# EAGLE design Sensorboard (EAGLE 6.1)
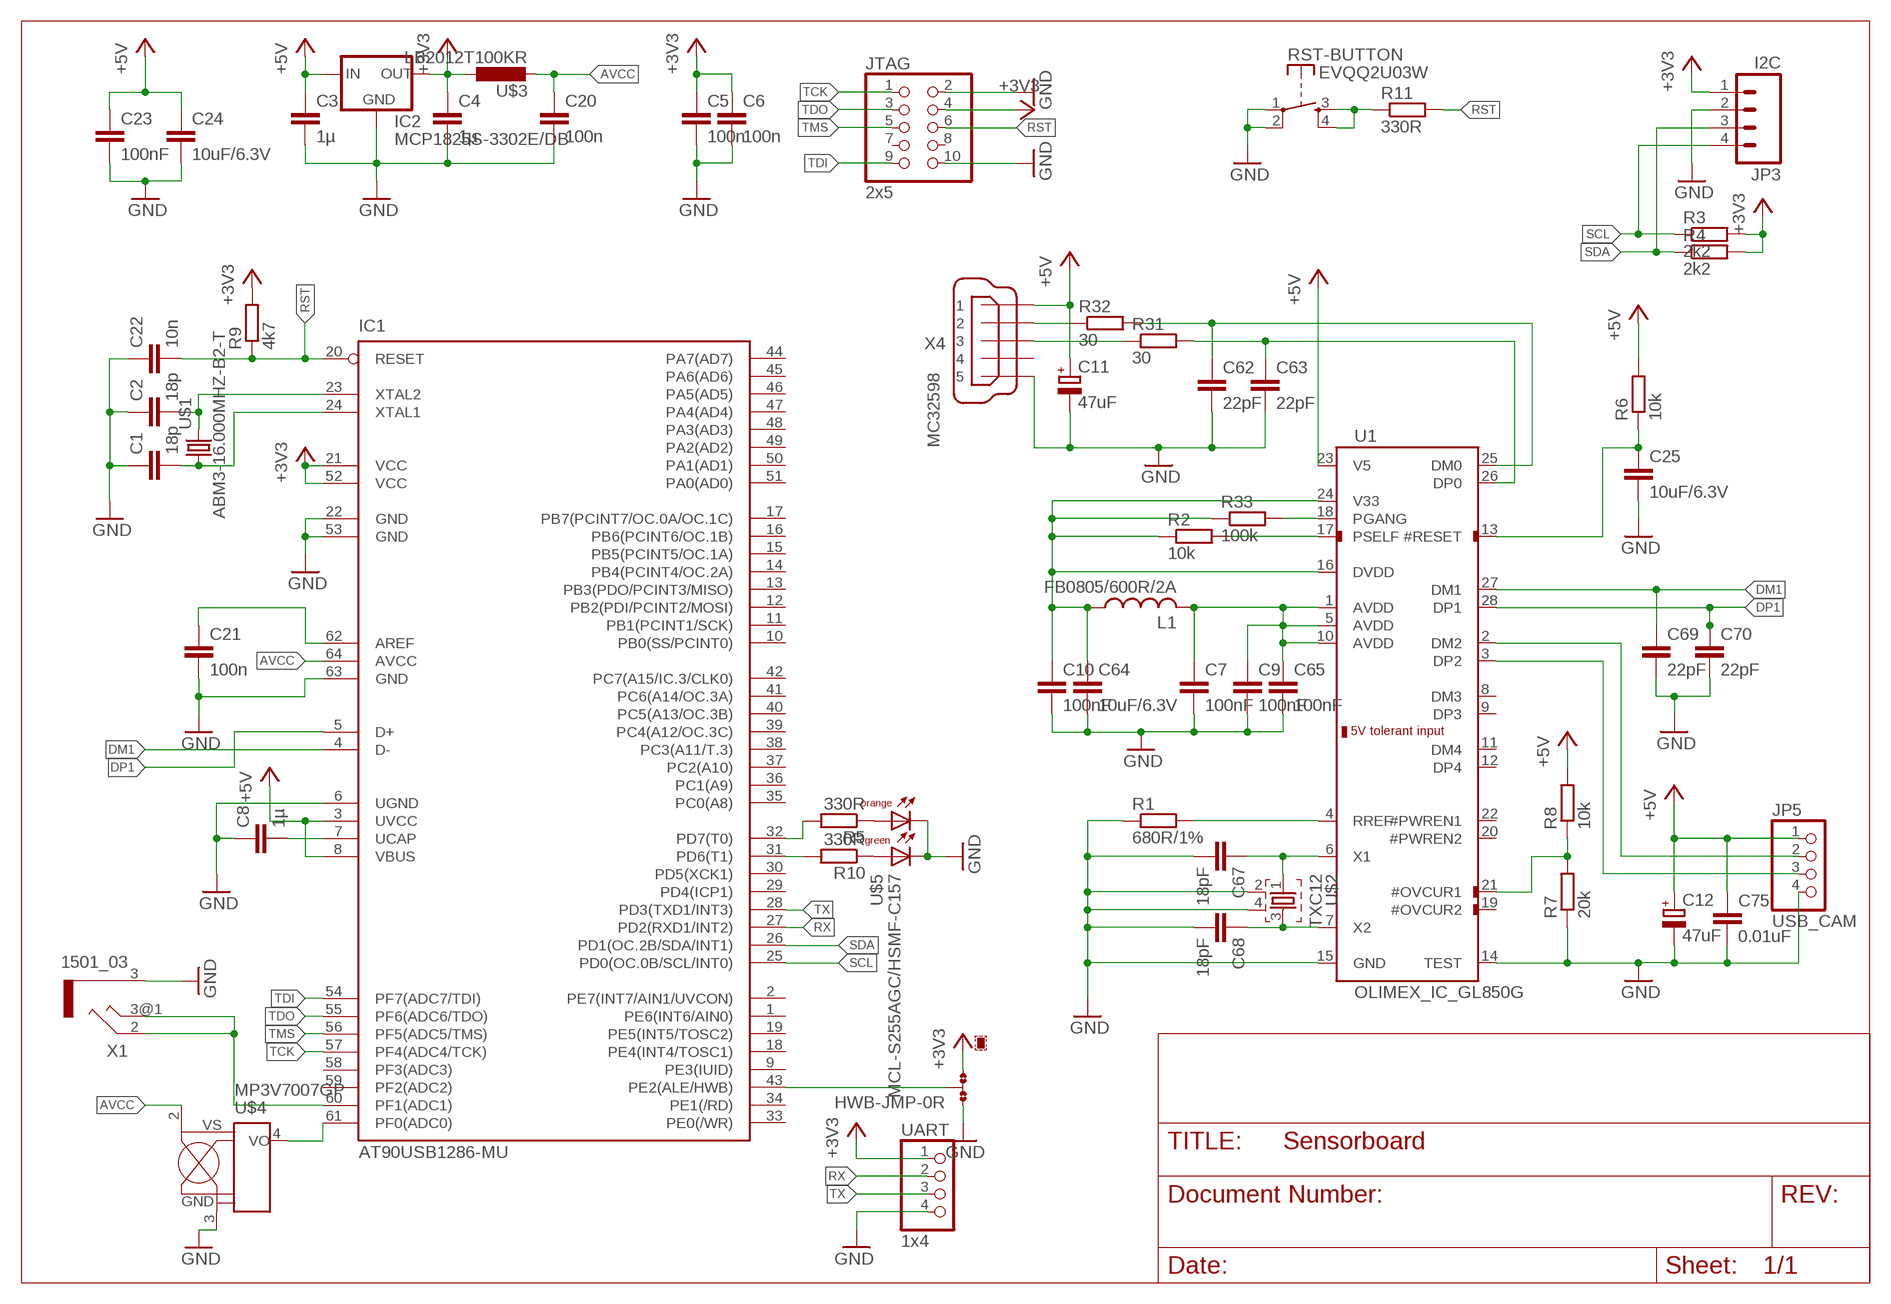
[diagram p0: schematic, sheet 1]

## Parts
C1  18p  C-EUC0603K  [C0603K]
C2  18p  C-EUC0603K  [C0603K]
C3  1µ  C-EUC0603K  [C0603K]
C4  1µ  C-EUC0603K  [C0603K]
C5  100n  C-EUC0603K  [C0603K]
C6  100n  C-EUC0603K  [C0603K]
C7  100nF  C-EUC0603  [C0603]
C8  1µ  C-EUC0603K  [C0603K]
C9  100nF  C-EUC0603  [C0603]
C10  100nF  C-EUC0603  [C0603]
C11  47uF  CPOL-EUSMCE  [SMC_E]
C12  47uF  CPOL-EUSMCE  [SMC_E]
C20  100n  C-EUC0603K  [C0603K]
C21  100n  C-EUC0603K  [C0603K]
C22  10n  C-EUC0603K  [C0603K]
C23  100nF  C-EUC0603  [C0603]
C24  10uF/6.3V  C-EUC0805  [C0805]
C25  10uF/6.3V  C-EUC0805  [C0805]
C62  22pF  C-EUC0603  [C0603]
C63  22pF  C-EUC0603  [C0603]
C64  10uF/6.3V  C-EUC0805  [C0805]
C65  100nF  C-EUC0603  [C0603]
C67  18pF  C-EUC0603  [C0603]
C68  18pF  C-EUC0603  [C0603]
C69  22pF  C-EUC0603  [C0603]
C70  22pF  C-EUC0603  [C0603]
C75  0.01uF  C-EUC0603  [C0603]
HWB-JMP  0R-JUMPB  [B0R-JMP]
IC1  AT90USB1286-MU  AT90USB1287-AU  [TQFP64]
IC2  MCP1825S-3302E/DB  MCP1825-SOT223  [SOT223]
JP3  I2C  M04PTH  [1X04]
JP5  USB_CAM  PINHD-1X4  [1X04]
JTAG  2x5  PINHD-2X5  [2X05]
L1  FB0805/600R/2A  L-USL3225P  [L3225P]
R1  680R/1%  R-EU_R0603  [R0603]
R2  10k  R-EU_R0603  [R0603]
R3  2k2  R-EU_R0603  [R0603]
R4  2k2  R-EU_R0603  [R0603]
R5  330R  R-EU_R0603  [R0603]
R6  10k  R-EU_R0603  [R0603]
R7  20k  R-EU_R0603  [R0603]
R8  10k  R-EU_R0603  [R0603]
R9  4k7  R-EU_R0603  [R0603]
R10  330R  R-EU_R0603  [R0603]
R11  330R  R-EU_R0603  [R0603]
R31  30  R-EU_R0603  [R0603]
R32  30  R-EU_R0603  [R0603]
R33  100k  R-EU_R0603  [R0603]
RST-BUTTON  EVQQ2U03W  SWITCH-SPNO  [EVQQ2]
U1  OLIMEX_IC_GL850G  [OLIMEX_IC_SSOP28]
U$1  ABM3-16.000MHZ-B2-T  TXC_ABM3  [SMD_5X3.2MM]
U$2  TXC12  [CTS406]
U$3  LB2012T100KR  L-TAIYO-YUDEN  [L-2012]
U$4  MP3V7007GP  [SOP-8]
U$5  MCL-S255AGC/HSMF-C157  DUOLED-MULTICOMP  [DUOLED-1210]
UART  1x4  PINHD-1X4  [1X04]
X1  1501_03  [1503_03]
X4  MC32598  MINI-USB-32005-201  [32005-201]

## Nets
+3V3: C4.1 C5.1 C6.1 HWB-JMP.3 IC1.21(VCC) IC1.52(VCC) IC2.3(OUT) JP3.1 JTAG.4 R3.2 R4.2 R9.2 U$3.1 UART.1
+5V: C3.1 C11.+ C12.+ C23.1 C24.1 C75.1 IC1.3(UVCC) IC1.8(VBUS) IC2.1(IN) JP5.1 R6.2 R8.2 U1.23(V5) X4.1
AVCC: C20.1 IC1.64(AVCC) U$3.2 U$4.2(VS)
DM1: C69.1 IC1.4(D-) U1.27(DM1)
DM2: JP5.2 U1.2(DM2)
DP1: C70.1 IC1.5(D+) U1.28(DP1)
DP2: JP5.3 U1.3(DP2)
GND: C1.1 C2.1 C3.2 C4.2 C5.2 C6.2 C7.2 C8.1 C9.2 C10.2 C11.- C12.- C20.2 C21.2 C22.1 C23.2 C24.2 C25.2 C62.2 C63.2 C64.2 C65.2 C67.2 C68.2 C69.2 C70.2 C75.2 HWB-JMP.1 IC1.6(UGND) IC1.22(GND) IC1.53(GND) IC1.63(GND) IC2.2(GND) IC2.4(GND) JP3.2 JP5.4 JTAG.2 JTAG.10 R1.1 R7.1 RST-BUTTON.1(P) RST-BUTTON.2(P) U1.14(TEST) U1.15(GND) U$2.2 U$2.4 U$4.3(GND) U$5.1(C) U$5.2(C) UART.4 X1.3 X4.5
N$1: C1.2 IC1.24(XTAL1) U$1.P$1
N$2: C2.2 IC1.23(XTAL2) U$1.P$2
N$3: C8.2 IC1.7(UCAP)
N$4: IC1.60(PF1(ADC1)) X1.2 X1.3@1
N$6: R33.2 U1.18(PGANG)
N$7: R1.2 U1.4(RREF)
N$8: R2.2 U1.17(PSELF)
N$9: C25.1 R6.1 U1.13(#RESET)
N$12: R5.1 U$5.4(AO)
N$14: C7.1 C9.1 C65.1 L1.2 U1.1(AVDD) U1.5(AVDD) U1.10(AVDD)
N$15: C21.1 IC1.62(AREF)
N$16: HWB-JMP.2 IC1.43(PE2(ALE/HWB))
N$17: IC1.31(PD6(T1)) R10.2
N$18: R10.1 U$5.3(AG)
N$19: IC1.32(PD7(T0)) R5.2
N$20: R11.1 RST-BUTTON.3(S) RST-BUTTON.4(S)
N$21: IC1.61(PF0(ADC0)) U$4.4(OUT)
N$23: C10.1 C64.1 L1.1 R2.1 R33.1 U1.16(DVDD) U1.24(V33)
N$24: R7.2 R8.1 U1.21(#OVCUR1)
N$72: C62.1 R32.2 U1.25(DM0)
N$73: R32.1 X4.2
N$74: R31.1 X4.3
N$75: C63.1 R31.2 U1.26(DP0)
N$78: C67.1 U1.6(X1) U$2.1
N$79: C68.1 U1.7(X2) U$2.3
RST: C22.2 IC1.20(RESET) JTAG.6 R9.1 R11.2
RX: IC1.27(PD2(RXD1/INT2)) UART.2
SCL: IC1.25(PD0(OC.0B/SCL/INT0)) JP3.4 R3.1
SDA: IC1.26(PD1(OC.2B/SDA/INT1)) JP3.3 R4.1
TCK: IC1.57(PF4(ADC4/TCK)) JTAG.1
TDI: IC1.54(PF7(ADC7/TDI)) JTAG.9
TDO: IC1.55(PF6(ADC6/TDO)) JTAG.3
TMS: IC1.56(PF5(ADC5/TMS)) JTAG.5
TX: IC1.28(PD3(TXD1/INT3)) UART.3
Unconnected: IC1.1(PE6(INT6/AIN0)) IC1.2(PE7(INT7/AIN1/UVCON)) IC1.9(PE3(IUID)) IC1.10(PB0(SS/PCINT0)) IC1.11(PB1(PCINT1/SCK)) IC1.12(PB2(PDI/PCINT2/MOSI)) IC1.13(PB3(PDO/PCINT3/MISO)) IC1.14(PB4(PCINT4/OC.2A)) IC1.15(PB5(PCINT5/OC.1A)) IC1.16(PB6(PCINT6/OC.1B)) IC1.17(PB7(PCINT7/OC.0A/OC.1C)) IC1.18(PE4(INT4/TOSC1)) IC1.19(PE5(INT5/TOSC2)) IC1.29(PD4(ICP1)) IC1.30(PD5(XCK1)) IC1.33(PE0(/WR)) IC1.34(PE1(/RD)) IC1.35(PC0(A8)) IC1.36(PC1(A9)) IC1.37(PC2(A10)) IC1.38(PC3(A11/T.3)) IC1.39(PC4(A12/OC.3C)) IC1.40(PC5(A13/OC.3B)) IC1.41(PC6(A14/OC.3A)) IC1.42(PC7(A15/IC.3/CLK0)) IC1.44(PA7(AD7)) IC1.45(PA6(AD6)) IC1.46(PA5(AD5)) IC1.47(PA4(AD4)) IC1.48(PA3(AD3)) IC1.49(PA2(AD2)) IC1.50(PA1(AD1)) IC1.51(PA0(AD0)) IC1.58(PF3(ADC3)) IC1.59(PF2(ADC2)) JTAG.7 JTAG.8 U1.8(DM3) U1.9(DP3) U1.11(DM4) U1.12(DP4) U1.19(#OVCUR2) U1.20(#PWREN2) U1.22(#PWREN1) X4.4

## Library data of the parts
C1-C10 C20-C25 C62-C65 C67-C70 C75 = rcl:C-EU: CAPACITOR, European symbol
C11 C12 = rcl:CPOL-EU: POLARIZED CAPACITOR, European symbol
HWB-JMP = jump-0r-smd:0R-JUMP: SMD 0R 0805 Jumper
IC1 = Sensorboard:AT90USB1287-*: Atmel AT90USB1287 AVR Microcontroller with USB Interface and 128kB Flash Memory
IC2 = Sensorboard:MCP1825-SOT223: VOLTAGE REGULATOR Output: 3.3V; 500 mA
JP3 = SparkFun:M04: Header 4 Standard 4-pin 0.1" header. Use with straight break away headers (SKU : PRT-00116), right angle break away headers (PRT-00553), swiss pins (PRT-00743), machine pins (PRT-00117), and female headers (PRT-00115). Molex polarized connector foot print use with SKU : PRT-08231 with associated crimp pins and housings.
JP5 UART = pinhead:PINHD-1X4: PIN HEADER
JTAG = pinhead:PINHD-2X5: PIN HEADER
L1 = rcl:L-US: INDUCTOR, American symbol
R1-R11 R31-R33 = rcl:R-EU_: RESISTOR, European symbol
RST-BUTTON = Sensorboard:SWITCH-SPNO: Switch - SPNO Panasonic EVQQ2T03W SMD package 6.5x6mm
U1 = A13-OLinuXino_Rev_C:OLIMEX_IC_GL850G
U$1 = Sensorboard:TXC_ABM3
U$2 = crystal:TXC12
U$3 = Sensorboard:L-TAIYO-YUDEN: Inductance Manufacturer: Taiyo Yuden; package: 2012, 2x1.25 mm
U$4 = Sensorboard:MP3V7007GP: MP3V7007GP Pressure Sensor Freescale gauge type pressure sensor range -7 to 7 kPa (-1 to 1 psi); Vs 3V Out 0.2 to 2.8V
U$5 = Sensorboard:DUOLED-MULTICOMP: LED orange/green MULTICOMP - MCL-S255AGC - LED,SMD,1210,ORANGE/GRUEN Hersteller: MULTICOMP Farnell Best.Nr.: 1581234 Herst.Bez.: MCL-S255AGC
X1 = con-lumberg:1501_03: Klinkensteckverbinder nach JISC 6560, 2,5 mm Jack connectors according to JISC 6560, 2.5 mm Source: http://www.lumberg.com/Produkte/PDFs/1501_03.pdf
X4 = con-cypressindustries:MINI-USB-: MINI USB-B Conector Source: www.cypressindustries.com; OC_FARNELL: unknown; OC_NEWARK: unknown

## Board
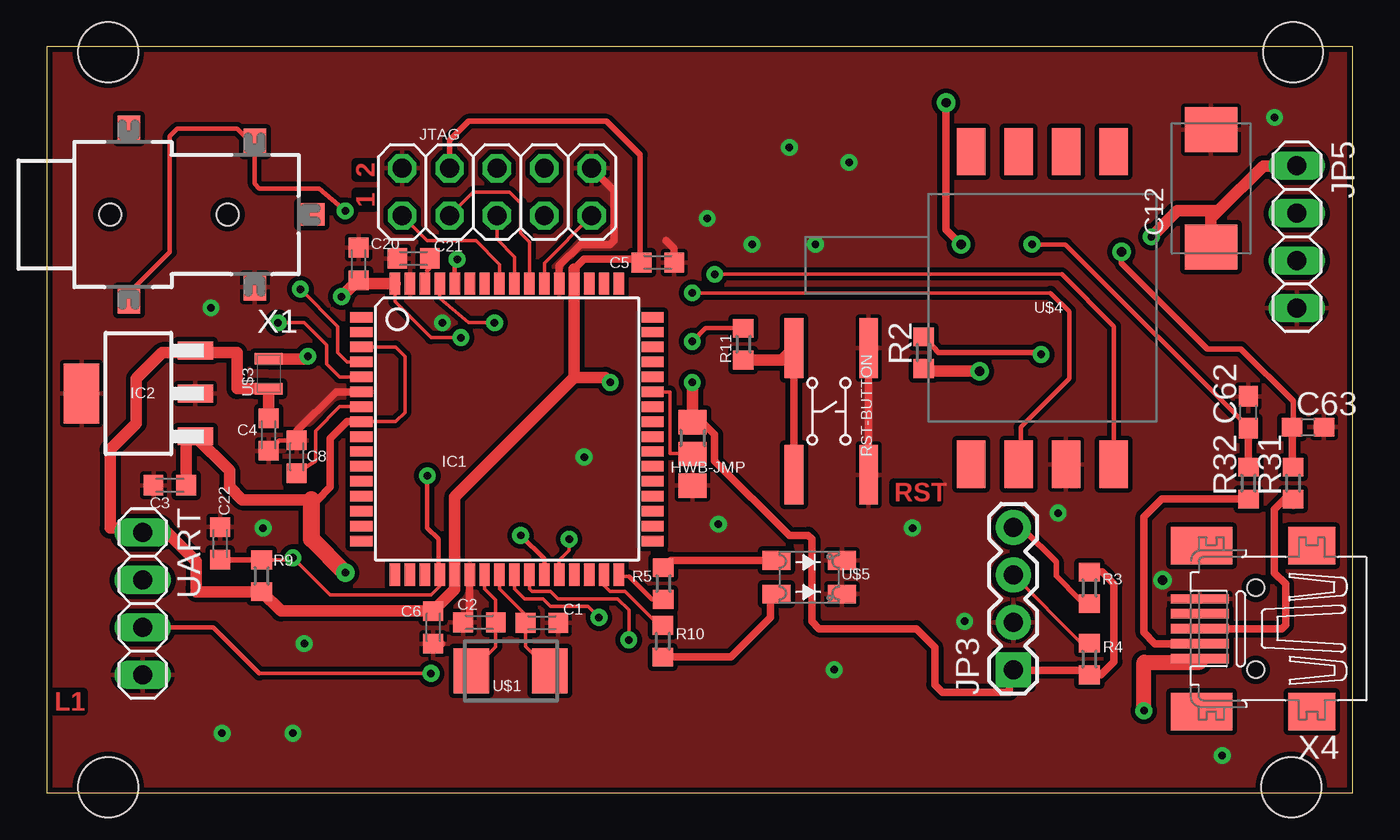
[diagram p1: board, top side]
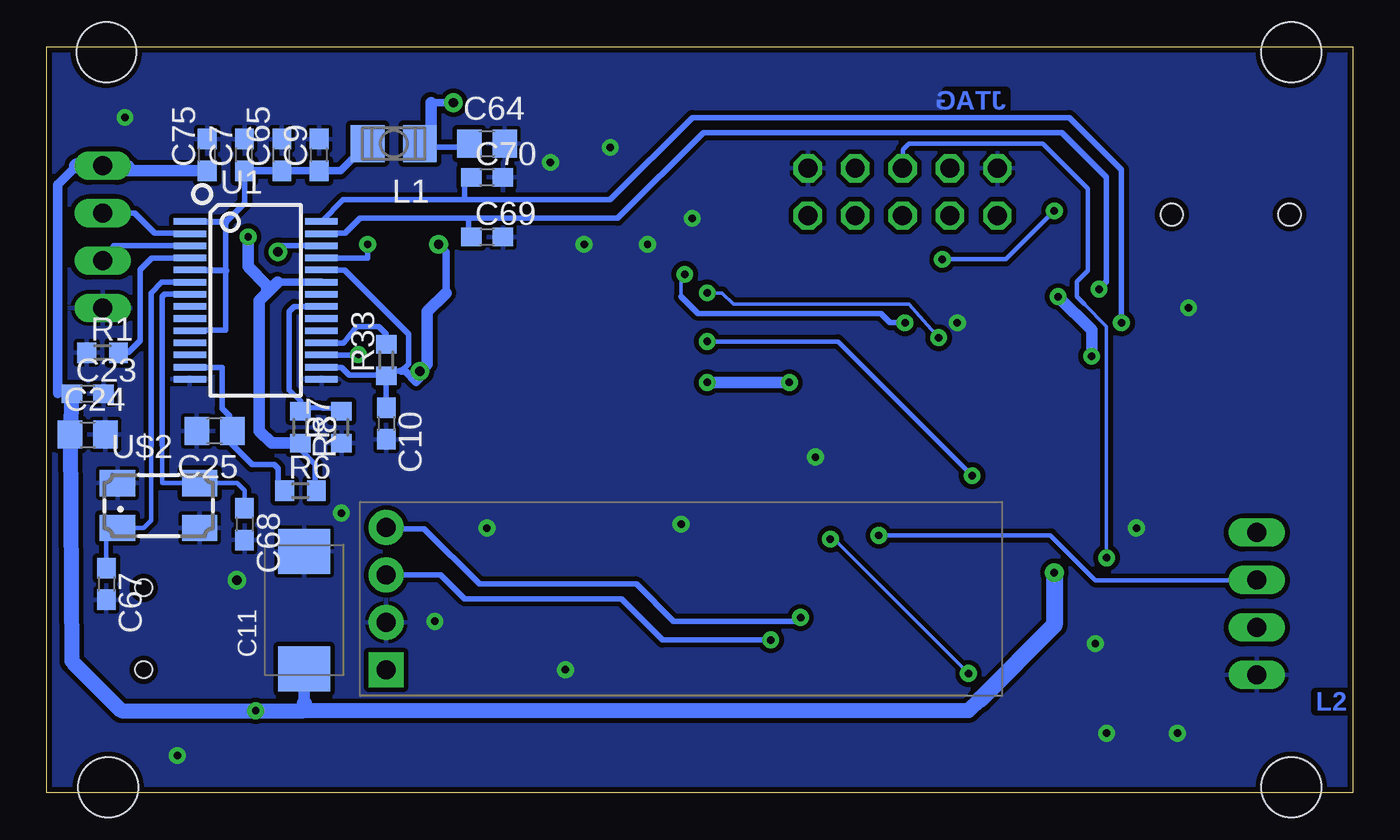
[diagram p2: board, bottom side, seen from below]

Size 70 x 40 mm. Coordinates in mm from the lower left corner, seen from the top.
Outline: 0,40 0,0 70,0 70,40 0,40
Copper layers (1*16): Top 0.035mm / dielectric 1.5mm / Bottom 0.035mm
Design rules: minimum track width 0.2mm, minimum drill 0.3mm, track to track 0.2mm, track to pad 0.2mm, pad to pad 0.2mm, via to via 0.2mm, smd to smd 0mil, copper to edge 0.3mm, drill to drill 0.2mm, minimum pad ring 0.25mm, minimum via ring 0.25mm, stop-mask expansion 2mil, vias tented up to drill 0.6mm, thermal gap 0.2mm
Holes 3.2 mm at 3.3,0.3 66.7,0.3 66.8,39.7 3.3,39.7

### Footprints (pad centres in the part's own frame; a part is rotated, then mirrored left to right if it is on the bottom)
C0603K = smd 1.05 x 1.08: 1 -0.875,0; 2 0.875,0
C0603 = smd 1.1 x 1: 1 -0.85,0; 2 0.85,0
SMC_E = smd 2.4 x 2.8: + -3.15,0; - 3.15,0
C0805 = smd 1.3 x 1.5: 1 -0.95,0; 2 0.95,0
B0R-JMP = smd 1.5 x 1.3: 1 0,1.7; 2 0,0; 3 0,-1.7
TQFP64 = smd 1.194 x 0.559: 1 -7.8,6; 2 -7.8,5.2; 3 -7.8,4.4; 4 -7.8,3.6; 5 -7.8,2.8; 6 -7.8,2; 7 -7.8,1.2; 8 -7.8,0.4; 9 -7.8,-0.4; 10 -7.8,-1.2; 11 -7.8,-2; 12 -7.8,-2.8; 13 -7.8,-3.6; 14 -7.8,-4.4; 15 -7.8,-5.2; 16 -7.8,-6; 33 7.8,-6; 34 7.8,-5.2; 35 7.8,-4.4; 36 7.8,-3.6; 37 7.8,-2.8; 38 7.8,-2; 39 7.8,-1.2; 40 7.8,-0.4; 41 7.8,0.4; 42 7.8,1.2; 43 7.8,2; 44 7.8,2.8; 45 7.8,3.6; 46 7.8,4.4; 47 7.8,5.2; 48 7.8,6 | smd 0.559 x 1.194: 17 -6,-7.8; 18 -5.2,-7.8; 19 -4.4,-7.8; 20 -3.6,-7.8; 21 -2.8,-7.8; 22 -2,-7.8; 23 -1.2,-7.8; 24 -0.4,-7.8; 25 0.4,-7.8; 26 1.2,-7.8; 27 2,-7.8; 28 2.8,-7.8; 29 3.6,-7.8; 30 4.4,-7.8; 31 5.2,-7.8; 32 6,-7.8; 49 6,7.8; 50 5.2,7.8; 51 4.4,7.8; 52 3.6,7.8; 53 2.8,7.8; 54 2,7.8; 55 1.2,7.8; 56 0.4,7.8; 57 -0.4,7.8; 58 -1.2,7.8; 59 -2,7.8; 60 -2.8,7.8; 61 -3.6,7.8; 62 -4.4,7.8; 63 -5.2,7.8; 64 -6,7.8
SOT223 = smd 0.95 x 1.9: 1 -2.3,-3.05; 2 0,-3.05; 3 2.3,-3.05 | smd 3.2 x 1.9: 4 0,3.05
1X04 = drill 1.016 pad 1.88 square: 1 0,0 | drill 1.016 pad 1.88: 2 2.54,0; 3 5.08,0; 4 7.62,0
1X04' = drill 1.016 long: 1 -3.81,0; 2 -1.27,0; 3 1.27,0; 4 3.81,0
2X05 = drill 1.016 octagon: 1 -5.08,-1.27; 2 -5.08,1.27; 3 -2.54,-1.27; 4 -2.54,1.27; 5 0,-1.27; 6 0,1.27; 7 2.54,-1.27; 8 2.54,1.27; 9 5.08,-1.27; 10 5.08,1.27
L3225P = smd 1.8 x 2: 1 -1.4,0; 2 1.4,0
R0603 = smd 1 x 1.1: 1 -0.85,0; 2 0.85,0
EVQQ2 = smd 3.2 x 1: 1 -3.4,2; 2 3.4,2; 3 3.4,-2; 4 -3.4,-2
OLIMEX_IC_SSOP28 = smd 0.35 x 1.75: 1 -4.225,-3.525; 2 -3.575,-3.525; 3 -2.925,-3.525; 4 -2.275,-3.525; 5 -1.625,-3.525; 6 -0.975,-3.525; 7 -0.325,-3.525; 8 0.325,-3.525; 9 0.975,-3.525; 10 1.625,-3.525; 11 2.275,-3.525; 12 2.925,-3.525; 13 3.575,-3.525; 14 4.225,-3.525; 15 4.225,3.525; 16 3.575,3.525; 17 2.925,3.525; 18 2.275,3.525; 19 1.625,3.525; 20 0.975,3.525; 21 0.325,3.525; 22 -0.325,3.525; 23 -0.975,3.525; 24 -1.625,3.525; 25 -2.275,3.525; 26 -2.925,3.525; 27 -3.575,3.525; 28 -4.225,3.525
SMD_5X3.2MM = smd 1.9 x 2.4: P$1 -2.1,0; P$2 2.1,0
CTS406 = smd 1.9 x 1.4: 1 -2.2,-1.2; 2 2.2,-1.2; 3 2.2,1.2; 4 -2.2,1.2
L-2012 = smd 0.6 x 1.5: 1 -0.8,0; 2 0.8,0
SOP-8 = smd 2.54 x 1.524: 1 8.382,-3.81; 2 8.382,-1.27; 3 8.382,1.27; 4 8.382,3.81; 5 -8.382,3.81; 6 -8.382,1.27; 7 -8.382,-1.27; 8 -8.382,-3.81
DUOLED-1210 = smd 1.5 x 1: 1 -1.75,-0.9; 2 -1.75,0.9; 3 1.75,0.9; 4 1.75,-0.9
1503_03 = smd 1.2 x 1.4: 1 0,-12.8 | smd 1.4 x 1.2: 2 -4.6,-3; 2@1 4.6,-3; 3 -3.9,-9.75; 3@1 3.9,-9.75 | hole 1.2: 0,-2; 0,-8.3
32005-201 = smd 3.1 x 0.5: 1 3,1.6; 2 3,0.8; 3 3,0; 4 3,-0.8; 5 3,-1.6 | smd 2.5 x 2: M1 -3,-4.45; M2 -3,4.45 | smd 3.3 x 2: M3 2.9,4.45; M4 2.9,-4.45 | hole 0.9: 0,2.2; 0,-2.2

### Placement (x,y rotation side)
C1  26.54,9.12 180 top
C2  23.19,9.14 0 top
C3  6.61,16.49 180 top
C4  11.9,19.2 270 top
C5  32.76,28.43 0 top
C6  20.71,8.87 270 top
C7  59.4,34.2 90 bottom
C8  13.4,18.02 270 top
C9  55.4,34.2 90 bottom
C10  51.8,19.8 270 bottom
C11  56.2,9.8 90 bottom
C12  62.4,32.4 90 top
C20  16.72,28.36 90 top
C21  19.66,28.65 180 top
C22  9.3,13.37 270 top
C23  67.8,21.4 0 bottom
C24  67.8,19.2 0 bottom
C25  61,19.4 180 bottom
C62  64.4,20.4 90 top
C63  67.6,19.6 0 top
C64  46.4,34.8 0 bottom
C65  57.4,34.2 90 bottom
C67  66.8,11.2 270 bottom
C68  59.4,14.4 270 bottom
C69  46.4,29.8 0 bottom
C70  46.4,33 0 bottom
C75  61.4,34.2 90 bottom
HWB-JMP  34.62,18.17 180 top
IC1  24.67,19.5 0 top
IC2  4.92,21.41 90 top
JP3  51.8,6.6 90 top
JP5  USB_CAM  [1X04']  67,29.8 270 top
JTAG  24.13,32.21 0 top
L1  51.4,34.8 180 bottom
R1  67,23.6 0 bottom
R2  47,23.6 90 top
R3  55.88,10.98 90 top
R4  55.88,7.17 270 top
R5  33.05,11.22 270 top
R6  56.4,16.2 0 bottom
R7  54.2,19.6 90 bottom
R8  56.4,19.6 270 bottom
R9  11.52,11.63 270 top
R10  33.02,8.13 90 top
R11  37.34,24.05 90 top
R31  66.8,16.6 90 top
R32  64.4,16.6 90 top
R33  51.8,23.2 90 bottom
RST-BUTTON  42.05,20.45 270 top
U1  58.8,26.4 270 bottom
U$1  24.87,6.54 180 top
U$2  64,15.4 0 bottom
U$3  11.9,22.46 90 top
U$4  53.36,25.99 270 top
U$5  40.87,11.56 180 top
UART  1x4  [1X04']  5.15,10.14 270 top
X1  1.4,31 90 top
X4  64.8,8.8 180 top

### Tracks (layer width: path | path; a pad name or v marks a point on that pad's centre or on a via)
+3V3  (via drill 0.4)
  Top 0.2: R4.2 55.43,6.58
  Top 0.305: 28.8,28.6 31.8,28.6 31.8,34.2 30,36 22.6,36 21.6,35 JTAG.4
  Top 0.4: IC1.52 28.27,28.07 28.8,28.6 31.71,28.6 C5.1
  Top 0.406: R4.2 56.49,6.33 57.2,7.04 57.2,11.2 56.56,11.84 R3.2 | 55.43,6.58 51.83,6.58 JP3.1 51.6,6.4 51.6,5.4 48,5.4 47.6,5.8 47.6,7.8 46.6,8.8 41.4,8.8 41,9.2 41,13.6 40.8,13.8 39.8,13.8 35.8,17.8 35.8,19.2 35.2,19.8 34.69,19.8 HWB-JMP.3
  Top 0.61: 8.6,23.6 10.2,23.6 10.2,21.66 U$3.1 C4.1 | 8.6,23.6 7.8,23.6 | 7.8,23.6 7.8,23.8 | IC2.3 8.6,23.71 8.6,23.6 | 8.2,10.78 R9.2 12.56,9.74 C6.1 21.87,10.9 IC1.21 21.87,15.87 28.27,22.27 | 8.2,10.78 8.02,10.78 | 7.8,23.6 6.2,23.6 4.8,22.2 4.8,19.8 3.4,18.4 3.4,14.2 5,14.2 | 28.27,28.07 28.27,22.27 | v34.6,22 34.6,19.89 HWB-JMP.3 | 28.27,22.27 29.93,22.27 v30.2,22 | 5,14.2 5.2,14.2 5.2,14 | 5,14.2 5,13.95 UART.1 6.45,13.95 8,12.4 8,10.98 8.2,10.78
  Top 0.9: C4.1
  Bottom 0.61: v30.2,22 v34.6,22
+5V  (via drill 0.4, 0.4 pad 1)
  Top 0.2: IC1.3 18.7,23.9 19.2,23.4 19.2,20.4 18.7,19.9 IC1.8
  Top 0.406: 14.2,15.71 14.51,15.71 15.2,16.4 15.2,19 16.1,19.9 IC1.8 | 61.8,7 X4.1
  Top 0.61: 62.8,31.2 65.2,33.6 67.2,33.6 JP5.1 | v59.2,29.8 60.6,31.2 62.8,31.2 | C3.1 7.48,19.11 IC2.1 9.8,17.28 9.8,16.4 10.49,15.71 14.2,15.71 | 62.8,31.2 62.4,30.8 C12.+ 62.4,29.2
  Top 0.813: v58.8,4.4 58.8,7 61.8,7
  Top 0.9: v16,11.8 14.2,13.6 14.2,15.71
  Bottom 0.305: 58.55,23.25 58.6,23.3 58.6,23.4 | 69.4,21.4 C23.1 | R6.2 55.6,16.25 55.6,17.6 56.4,18.4 R8.2
  Bottom 0.406: 57.62,27.38 U1.23
  Bottom 0.5: 68.39,33.61 69.4,32.6 69.4,21.4
  Bottom 0.61: 58.2,26.8 58.6,26.4 58.6,23.4 58.6,19.4 57.95,18.75 R8.2 | 57.62,27.38 58.2,26.8 | 58.2,26.8 58.2,27.2 59.2,28.2 v59.2,29.8 | C75.1 65.6,33.35 65.6,33.6 67.2,33.6 JP5.1 | C11.+ 56.2,4.8 | 68.65,7.05 68.6,7
  Bottom 0.813: 68.6,7 66,4.4 v58.8,4.4 56.2,4.4 | JP5.1 68.39,33.61 | C23.1 C24.1 68.65,7.05 | 56.2,4.4 56.2,4.8 | 20,5 20.6,4.4 56.2,4.4
  Bottom 0.9: v16,11.8 16,9 20,5
AVCC  (via drill 0.4, 0.4 pad 0.81)
  Top 0.2: IC1.64 18.67,26.33 20.6,24.4 v22.2,24.4 | v34.6,26.8 53.8,26.8
  Top 0.254: U$4.2 52.19,17.61 52.2,17.6 52.2,19.6 54.8,22.2 54.8,25.8 53.8,26.8
  Top 0.4: 16.9,27.3 C20.1 16.68,27.48
  Top 0.406: 13.87,23.27 v14,23.4
  Top 0.61: U$3.2 13.87,23.27 | IC1.64 16.9,27.3 | 16.68,27.48 v15.8,26.6
  Bottom 0.2: v22.2,24.4 23.8,26.2 33.2,26.2 33.8,26.8 v34.6,26.8
  Bottom 0.61: v14,23.4 14,24.8 v15.8,26.6
DM1  (via drill 0.4)
  Top 0.2: IC1.4 16.1,23.1 15.6,23.6 15.6,25 v13.6,27
  Bottom 0.305: 47.4,30.8 39.4,30.8 34.8,35.4 15.6,35.4 13.2,33 13.2,27.4 v13.6,27 | U1.27 55.23,29.98 55.2,30 54,30 53.2,30.8 47.4,30.8 | C69.1 47.4,29.95 47.4,30.8
DM2
  Bottom 0.305: U1.2 62.35,30 64.2,30 65.27,31.07 JP5.2
DP1  (via drill 0.4)
  Top 0.2: v12.4,25.2 13.8,25.2 15,24 15,23 15.7,22.3 IC1.5
  Bottom 0.305: 47.6,31.8 54.1,31.8 U1.28 | 47.6,31.8 39.8,31.8 35.4,36.2 15.2,36.2 12.4,33.4 v12.4,25.2 | C70.1 47.6,32.65 47.6,31.8
DP2
  Bottom 0.305: U1.3 66.41,29.32 JP5.3
GND  (via drill 0.4, 0.4 pad 0.81, 0.4 pad 0.9, 0.5)
  Top 0.254: C4.2 12.46,18.89 C8.1
  Top 0.4: IC1.53 27.47,28.27 28.6,29.4 30.2,29.4 30.4,29.6 30.4,32.29 JTAG.10 | C8.1 13.4,19.4 15.5,21.5 IC1.6 | RST-BUTTON.2 RST-BUTTON.1 | IC1.22 22.67,9.49 C2.1 | C6.2 21.17,8 | C5.2 33.63,29.17 33.2,29.6
  other vias: 36,14.4 9.4,3.2 13.2,3.2 54.2,15 11.6,14.2 21.2,25.2 35.4,30.8 39.8,34.6 63,2 43,33.8 28.8,18 41.2,29.4 37.8,29.4 59.8,11.4 46.4,14.2 42.2,6.6 13.8,8 65.8,36.2 8.8,26 49.2,9.2
  pour Top (isolate 0.254): 70,0 0,0 0,40.02 70,40
  pour Bottom (isolate 0.254): 0,40.02 0,0 70,0 70,40
N$1
  Top 0.2: IC1.24 24.27,10.93 25.66,9.54 C1.2 25.66,7.84 U$1.P$1
N$2
  Top 0.2: IC1.23 23.47,10.93 24.07,10.34 C2.2 24.07,7.83 U$1.P$2
N$3
  Top 0.2: C8.2 14.4,17.8 14.4,19.4 15.7,20.7 IC1.7
N$4  (via drill 0.4)
  Top 0.254: IC1.60 21.87,28.27 v22,28.6 | v16,31.2 14.6,32.4 11.4,32.4 11.15,32.65 X1.3@1 10.9,34.9 10.2,35.6 7,35.6 6.6,35.2 6.6,29 4.4,26.8
  Top 0.406: X1.2 4.4,26.8
  Bottom 0.254: v22,28.6 18.6,28.6 v16,31.2
N$6
  Bottom 0.305: U1.18 54.08,24.12 53.4,25 52.2,25 51.8,24.6 R33.2 52.2,24
N$7
  Bottom 0.305: R1.2 65.64,23.6 65,24.23 65,28.04 64.36,28.68 U1.4
N$8  (via drill 0.4)
  Top 0.305: R2.2 47.8,23.6 53.2,23.6 v53.3,23.5
  Bottom 0.305: U1.17 53.33,23.48 v53.3,23.5
N$9
  Bottom 0.305: U1.13 62.3,22.8 60.6,22.8 60.6,20.6 60.2,20.2 60.2,19.4 C25.1 | R6.1 57.6,16.55 57.6,17.4 57.8,17.6 59,17.6 60.15,18.75 C25.1 | 60.55,19.15 C25.1
N$12
  Top 0.254: 33.07,12.07 R5.1
  Top 0.406: 33.07,12.07 33.46,12.46 U$5.4
N$14
  Bottom 0.305: C7.1 59.4,31.6 60.4,30.6 | 60.4,30.6 62.3,30.6 U1.1 60.42,30.62 | 60.4,30.6 60.4,28 | 60.4,28 62.3,28 U1.5 60.42,28.02 | 60.4,28 60.4,24.8 62.3,24.8 U1.10
  Bottom 0.406: C7.1 C65.1 C9.1 54.25,33.35 L1.2 | 60.42,30.62 60.4,30.6 | 60.42,28.02 60.4,28
N$15
  Top 0.2: 20.4,28 20.4,27.43 IC1.62
  Top 0.254: C21.1 20.54,28.14 20.4,28
N$16
  Top 0.2: IC1.43 33.4,21.5 33.4,18.2 34.62,18.2 HWB-JMP.2
N$17
  Top 0.2: R10.2 32.82,8.98 31,10.8 30.2,10.8 29.87,11.13 IC1.31
N$18
  Top 0.406: R10.1 36.68,7.28 38.8,9.4 38.8,10.35 U$5.3
N$19
  Top 0.2: 31.2,11.6 30.77,11.6 IC1.32
  Top 0.254: 31.2,11.6 32.43,10.37 R5.2
N$20
  Top 0.4: RST-BUTTON.3 RST-BUTTON.4
  Top 0.61: R11.1 39.4,23.2 RST-BUTTON.4
N$21  (via drill 0.4 pad 0.81)
  Top 0.2: 54.4,27.8 v35.8,27.8 | v24,25.2 22.6,25.2 21.07,26.53 IC1.61
  Top 0.254: 54.4,27.8 57.2,25 57.2,17.64 U$4.4
  Bottom 0.2: 36,26.6 36,27.4 35.8,27.6 v35.8,27.8
  Bottom 0.305: v24,25.2 24.8,25.2 25.3,25.7 35.1,25.7 36,26.6
N$23  (via drill 0.5)
  Top 0.406: v49,29.4 48.2,30.2 v48.2,37
  Top 0.61: R2.1 46.8,22.6 v50,22.6
  Bottom 0.305: U1.16 55.3,22.8 54.2,22.8 53.8,22.4 52.2,22.4 | C64.1 47.45,34.6 49.4,34.6 | C10.1 R33.1 52.2,22.4 | U1.24 54.02,28.02 50.6,24.6 50.6,23 51,22.6 52,22.6 52.2,22.4
  Bottom 0.406: L1.1 49.6,34.8 49.4,34.6 | v50,22.6 50,22.2 50.2,22 50.8,22.6 51,22.6 | 49.4,37 v48.2,37 | v49,29.4 48.6,29 48.6,26.8
  Bottom 0.61: v50,22.6 49.6,23 49.6,25.8 48.6,26.8 | 49.4,34.6 49.4,37
N$24
  Bottom 0.305: U1.21 56.73,26.07 57,25.8 57,21.6 56.4,21 R8.1 56.4,20.6 56.35,20.65 54.2,20.6 R7.2
N$72  (via drill 0.4)
  Top 0.254: 64.4,19.6 54.6,29.4 v52.8,29.4
  Top 0.406: R32.2 C62.1 64.4,19.6
  Bottom 0.305: U1.25 52.8,28.68 v52.8,29.4
N$73
  Top 0.406: 64.4,15.8 R32.1 59.75,15.75 58.8,14.8 58.8,8.6 59.4,8 X4.2
N$74
  Top 0.406: 66.8,15.4 R31.1 66.35,15.75 65.8,15.2 65.8,11.8 66.4,11.2 66.4,9 66.2,8.8 X4.3
N$75  (via drill 0.5)
  Top 0.305: C63.1 66.8,19.65 66.8,21 64,23.8 62.2,23.8 57.6,28.4 v57.6,29
  Top 0.406: R31.2 66.75,17.5 C63.1
  Bottom 0.305: U1.26 57.6,29.32 v57.6,29
N$78
  Bottom 0.254: 64.4,18.6 64.4,14.6 64.8,14.2 U$2.1 66.6,14.2 66.8,14 C67.1
  Bottom 0.305: 64.4,18.6 64.4,26.8 63.83,27.38 U1.6
N$79
  Bottom 0.254: 63.8,18.64 63.8,16.6 U$2.3 59.8,16.6 59.4,16.2 C68.1
  Bottom 0.305: U1.7 63.67,26.73 63.8,26.6 63.8,18.64
RST  (via drill 0.4, 0.4 pad 0.9)
  Top 0.2: IC1.20 21.07,11.07 20.6,10.6 15.2,10.6 v13.2,12.6 13.08,12.48 R9.1
  Top 0.254: R11.2 35.3,24.9 v34.6,24.2 | v20.4,17 20.4,14.2 21,13.6 21,11.77 IC1.20
  Top 0.305: C22.2 11.51,12.49 R9.1
  Bottom 0.2: 14.4,26.2 13.2,25 v13.2,12.6
  Bottom 0.254: JTAG.6 24.12,34.48 23.8,34.8 16.6,34.8 14.2,32.4 14.2,28 14.8,27.4 14.8,26.6 14.4,26.2 | v34.6,24.2 27.6,24.2 v20.4,17
RX  (via drill 0.4)
  Top 0.254: IC1.27 26.67,12.53 v25.4,13.8
  Bottom 0.254: v25.4,13.8 16.2,13.8 13.8,11.4 UART.2
SCL  (via drill 0.4)
  Top 0.2: 55.37,10.35 55.66,10.35 R3.1 | IC1.25 25.07,10.93 25.6,10.4 26.6,10.4 27,10 29,10 v29.6,9.4
  Top 0.254: 52.32,14.16 52.26,14.22 JP3.4
  Top 0.305: 52.32,14.16 54.1,12.38 54.1,11.62 55.37,10.35
  Bottom 0.2: v29.6,9.4 29.8,9.2
  Bottom 0.254: JP3.4 51.74,14.16
  Bottom 0.305: 29.8,9.2 36.4,9.2 38.4,11.2 46.8,11.2 49.76,14.16 51.74,14.16
SDA  (via drill 0.4)
  Top 0.2: R4.1 55.45,8.03 JP3.3 | IC1.26 25.87,10.93 26,10.8 27,10.8 27.4,10.4 30.6,10.4 31.2,9.8 v31.2,8.2
  Bottom 0.2: JP3.3 51.32,11.68
  Bottom 0.305: v31.2,8.2 37,8.2 39.2,10.4 47.6,10.4 48.88,11.68 JP3.3
TCK
  Top 0.2: JTAG.1 20.39,29.6 23,29.6 24.27,28.33 IC1.57
TDI
  Top 0.2: IC1.54 26.67,28.4 JTAG.9
TDO
  Top 0.2: JTAG.3 22.85,32.2 24.8,32.2 25.4,31.6 25.4,30 25.87,29.53 IC1.55
TMS
  Top 0.2: JTAG.5 24.13,29.67 25.07,28.73 IC1.56
TX  (via drill 0.4)
  Top 0.2: v28,13.6 28,13 27.47,12.47 IC1.28 | v20.6,6.4 11.4,6.4
  Top 0.254: UART.3 8.93,8.87 11.4,6.4
  Bottom 0.2: v28,13.6 27.8,13.6 v20.6,6.4

### Text on the board
Top: 2 | 1 | RST | L1
Bottom: JTAG | L2
bDocu: SEN-10724